# EAGLE design WeatherSharkCustom (EAGLE 8.3.2)
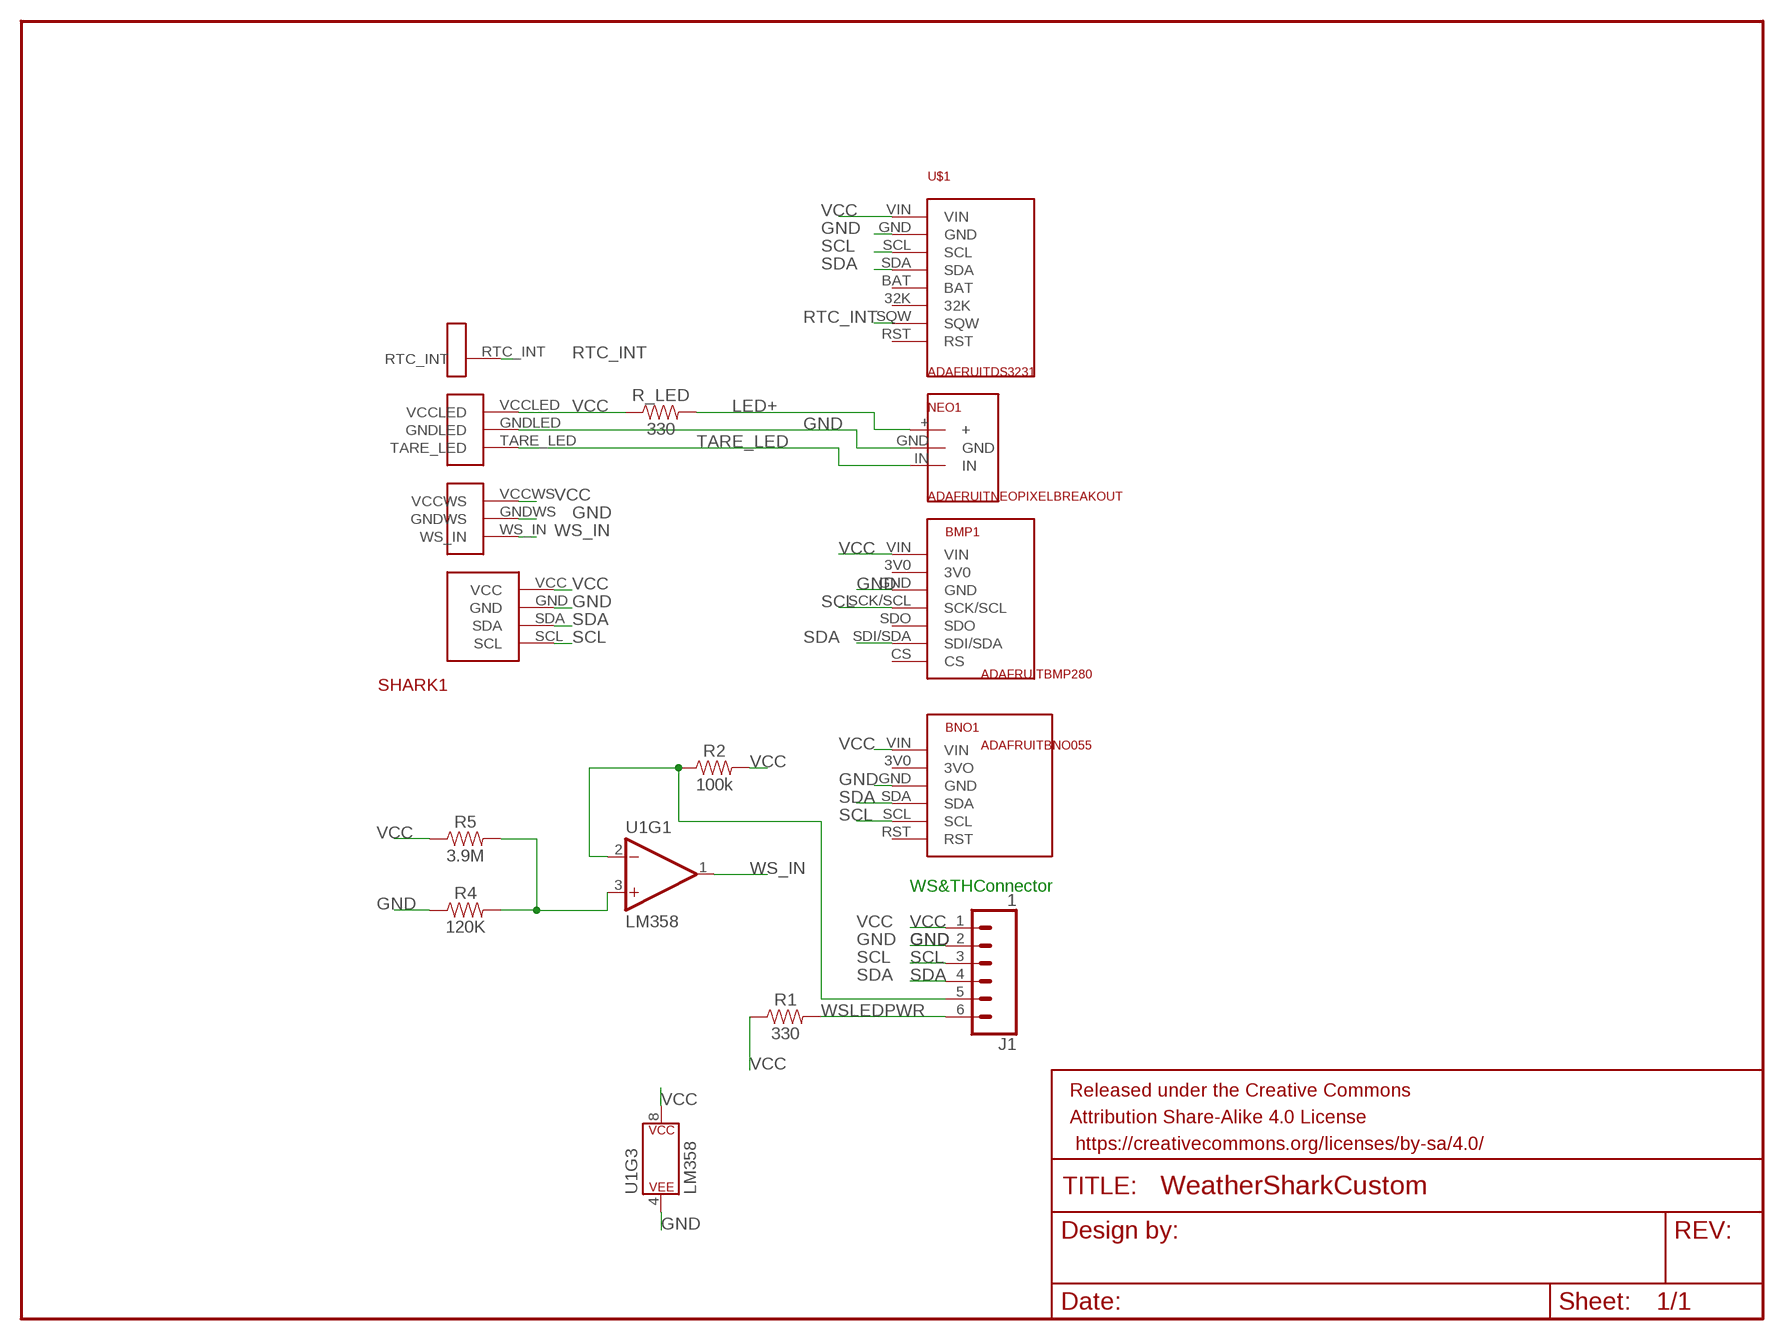
[diagram p0: schematic, sheet 1]

## Parts
BMP1  ADAFRUITBMP280  [ADAFRUITBMP280]
BNO1  ADAFRUITBNO055  [ADAFRUITBNO055]
FRAME1  FRAME-LETTER  [CREATIVE_COMMONS]
J1  1  CONN_06POLAR  [MOLEX-1X6]
NEO1  ADAFRUITNEOPIXELBREAKOUT  [ADAFRUITNEOPIXELBREAKOUT]
R1  330  330OHM-HORIZ-1/10W-5%  [AXIAL-0.3]
R2  100k  100KOHM-HORIZ-1/4W-1%  [AXIAL-0.3]
R4  120K  330OHM-HORIZ-1/10W-5%  [AXIAL-0.3]
R5  3.9M  330OHM-HORIZ-1/10W-5%  [AXIAL-0.3]
R_LED  330  330OHM-HORIZ-1/10W-5%  [AXIAL-0.3]
SHARK1  EVAPSHARK  [EVAPSHARK]
U1  LM358  LM358KIT  [DIP08-KIT]
U$1  ADAFRUITDS3231  [ADAFRUITDS3231]

## Nets
COMP: R4.P$2 R5.P$2 U1.3(+IN)
GND: BMP1.GND BNO1.GND J1.2 NEO1.GND R4.P$1 SHARK1.GND SHARK1.GNDLED SHARK1.GNDWS U1.4(P$V-) U$1.GND
LED+: NEO1.+ R_LED.P$2
RTC_INT: SHARK1.RTC_INT U$1.SQW
SCL: BMP1.SCK/SCL BNO1.SCL J1.3 SHARK1.SCL U$1.SCL
SDA: BMP1.SDI/SDA BNO1.SDA J1.4 SHARK1.SDA U$1.SDA
TARE_LED: NEO1.IN SHARK1.TARE_LED
VCC: BMP1.VIN BNO1.VIN J1.1 R1.P$1 R2.P$2 R5.P$1 R_LED.P$1 SHARK1.VCC SHARK1.VCCLED SHARK1.VCCWS U1.8(P$V+) U$1.VIN
WS_IN: SHARK1.WS_IN U1.1(OUT)
WSLEDPWR: J1.6 R1.P$2
WSSIGNAL: J1.5 R2.P$1 U1.2(-IN)
Unconnected: BMP1.3V0 BMP1.CS BMP1.SDO BNO1.3V0(3VO) BNO1.RST U1.5(+IN) U1.6(-IN) U1.7(OUT) U$1.32K U$1.BAT U$1.RST

## Notes on the sheet
- WS&THConnector

## Library data of the parts
BMP1 = WeatherShark:ADAFRUITBMP280
BNO1 = WeatherShark:ADAFRUITBNO055: BNO055 Footprint for use with weatheshark, etc
FRAME1 = SparkFun-Aesthetics:FRAME-LETTER: Schematic Frame Standard 8.5x11 US Letter frame
J1 = SparkFun-Connectors:CONN_06: Multi connection point. Often used as Generic Header-pin footprint for 0.1 inch spaced/style header connections On any of the 0.1 inch spaced packages, you can populate with these: Break Away Headers - Straight <https://www.sparkfun.com/products/116> (PRT-00116) Break Away Male Headers - Right Angle <https://www.sparkfun.com/products/553> (PRT-00553) Female Headers <https://www.sparkfun.com/products/115> (PRT-00115) Break Away Headers - Machine Pin <https://www.sparkfun.com/products/117> (PRT-00117) Break Away Female Headers - Swiss Machine Pin <https://www.sparkfun.com/products/743> (PRT-00743) Arduino Stackable Header - 6 Pin <https://www.sparkfun.com/products/9280> (PRT-09280) For SCREWTERMINALS and SPRING TERMINALS visit here: Screw Terimnals on SparkFun.com <https://www.sparkfun.com/search/results?term=Screw+Terminals> (5mm/3.5mm/2.54mm spacing) This device is also useful as a general connection point to wire up your design to another part of your project. Our various solder wires solder well into these plated through hole pads. Hook-Up Wire - Assortment (Stranded, 22 AWG) <https://www.sparkfun.com/products/11375> (PRT-11375) Hook-Up Wire - Assortment (Solid Core, 22 AWG) <https://www.sparkfun.com/products/11367> (PRT-11367) View the entire wire category on our website here <https://www.sparkfun.com/categories/141>
NEO1 = WeatherShark:ADAFRUITNEOPIXELBREAKOUT: Neopixel Footprint for weather shark
R1 R_LED = SparkFun-Resistors:330OHM: 330Ω resistor A resistor is a passive two-terminal electrical component that implements electrical resistance as a circuit element. Resistors act to reduce current flow, and, at the same time, act to lower voltage levels within circuits. - Wikipedia; PROD_ID: RES-8371
R2 = SparkFun-Resistors:100KOHM: 100kΩ resistor A resistor is a passive two-terminal electrical component that implements electrical resistance as a circuit element. Resistors act to reduce current flow, and, at the same time, act to lower voltage levels within circuits. - Wikipedia; PROD_ID: RES-12184
R4 R5 = SparkFun-Resistors:330OHM: 330Ω resistor A resistor is a passive two-terminal electrical component that implements electrical resistance as a circuit element. Resistors act to reduce current flow, and, at the same time, act to lower voltage levels within circuits. - Wikipedia; PROD_ID: RES-8371; VALUE: 330
SHARK1 = WeatherShark:EVAPSHARK: EvapShark foot print for the weathershark
U1 = SparkFun-IC-Amplifiers:LM358: LM358 Jellybean op-amp Datasheet <http://www.sparkfun.com/datasheets/Components/General/LM358.pdf> SparkFun Products Op-Amp (Thru-Hole) - LM358 <https://www.sparkfun.com/products/9456> (COM-09456); PROD_ID: IC-09172
U$1 = WeatherShark:ADAFRUITDS3231: ADAFruit DS3231 foot print for Weather Shark

## Board
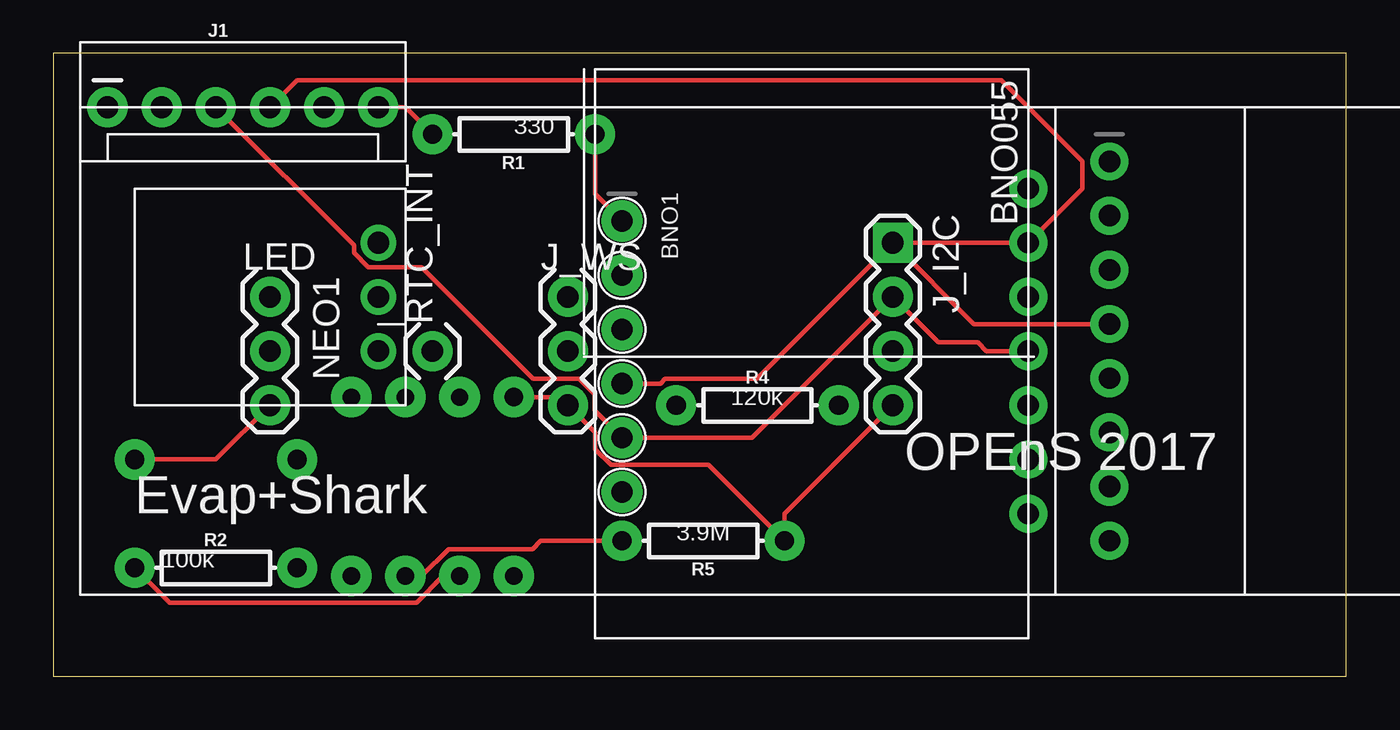
[diagram p1: board, top side]
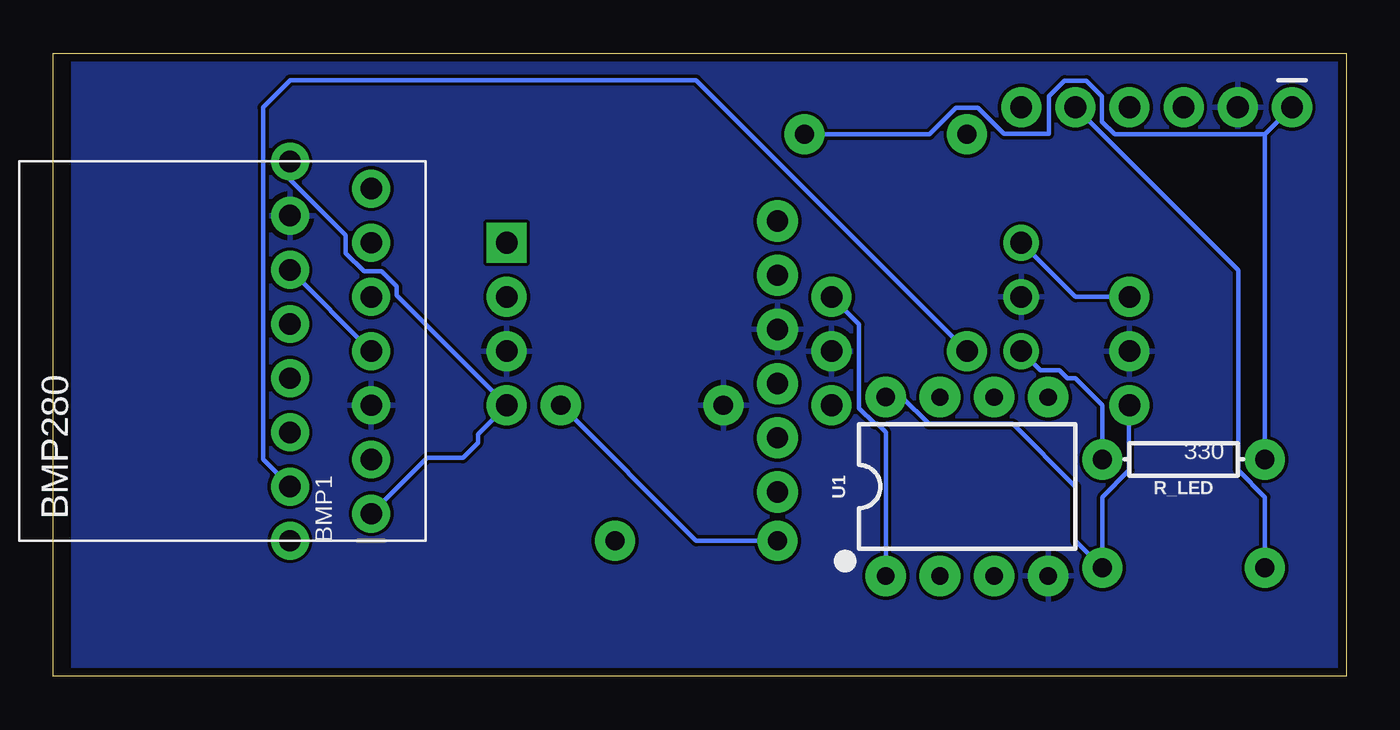
[diagram p2: board, bottom side, seen from below]

Size 60.63 x 29.2 mm. Coordinates in mm from the lower left corner, seen from the top.
Outline: 0,0 60.63,0 60.63,29.2 0,29.2 0,0
Copper layers (1*16): Top 0.0356mm / dielectric 1.5011mm / Bottom 0.0356mm
Design rules "oshpark-2layer": minimum track width 6mil, minimum drill 13mil, track to track 6mil, track to pad 6mil, pad to pad 6mil, via to via 6mil, smd to smd 6mil, copper to edge 15mil, drill to drill 6mil, minimum pad ring 7mil, minimum via ring 7mil, stop-mask expansion 2.5mil, vias tented up to drill 0mil, thermal gap 10mil

### Footprints (pad centres in the part's own frame; a part is rotated, then mirrored left to right if it is on the bottom)
ADAFRUITBMP280 = drill 1 pad 1.778: 3V0 3.81,2.54; CS 16.51,2.54; GND 6.35,2.54; SCK/SCL 8.89,2.54; SDI/SDA 13.97,2.54; SDO 11.43,2.54; VIN 1.27,2.54
ADAFRUITBNO055 = drill 1 pad 1.93: 3V0 -3.556,0; GND -1.016,0; RST 6.604,0; SCL 4.064,0; SDA 1.524,0; VIN -6.096,0
MOLEX-1X6 = drill 1.016 pad 1.88: 1 0,0; 2 2.54,0; 3 5.08,0; 4 7.62,0; 5 10.16,0; 6 12.7,0
ADAFRUITNEOPIXELBREAKOUT = drill 1.016 pad 1.676: + 11.43,2.54; GND 11.43,5.08; IN 11.43,7.62
AXIAL-0.3 = drill 0.9 pad 1.88: P$1 -3.81,0; P$2 3.81,0
EVAPSHARK = drill 1.016 pad 1.88: GND 0,2.54; GNDLED -29.21,2.54; GNDWS -15.24,2.54; RTC_INT -21.59,2.54; SCL 0,5.08; TARE_LED -29.21,5.08; VCC 0,0; VCCLED -29.21,0; VCCWS -15.24,0; WS_IN -15.24,5.08 | drill 1.016 pad 1.88 square: SDA 0,7.62
DIP08-KIT = drill 0.813 pad 1.905: 1 -3.81,-4.191; 2 -1.27,-4.191; 3 1.27,-4.191; 4 3.81,-4.191; 5 3.81,4.191; 6 1.27,4.191; 7 -1.27,4.191 | drill 0.864 pad 1.905: 8 -3.81,4.191
ADAFRUITDS3231 = drill 1 pad 1.778: 32K 15.24,2.54; BAT 12.7,2.54; GND 5.08,2.54; RST 20.32,2.54; SCL 7.62,2.54; SDA 10.16,2.54; SQW 17.78,2.54; VIN 2.54,2.54

### Placement (x,y rotation side)
BMP1  43.18,6.35 90 bottom
BNO1  26.67,15.24 270 top
FRAME1  -105.41,30.48 0 top  (outside the outline)
J1  2.54,26.67 0 top
NEO1  3.81,12.7 0 top
R1  21.59,25.4 180 top
R2  7.62,5.08 0 top
R4  33.02,12.7 0 top
R5  30.48,6.35 180 top
R_LED  7.62,10.16 180 bottom
SHARK1  39.37,12.7 0 top
U1  17.78,8.89 0 bottom
U$1  46.99,26.67 270 top

### Tracks (layer width: path | path; a pad name or v marks a point on that pad's centre or on a via)
COMP
  Top 0.203: U1.3 17.27,4.7 18.53,5.96 22.47,5.96 22.86,6.35 R5.P$2
  Bottom 0.203: R5.P$2 30.48,6.35 R4.P$2
GND
  pour Bottom: 0,29.21 59.69,29.21 59.69,0 0,0
LED+
  Bottom 0.203: R_LED.P$2 11.43,12.7 12.7,13.97 13.08,13.97 13.45,14.34 14.34,14.34 NEO1.+
RTC_INT
  Bottom 0.203: SHARK1.RTC_INT 30.48,27.94 49.53,27.94 50.8,26.67 50.8,10.16 U$1.SQW
SCL
  Top 0.203: J1.3 14.1,20.19 14.1,19.85 14.77,19.18 17.27,19.18 22.5,13.95 24.65,13.95 25.38,13.22 25.38,12.47 BNO1.SCL 32.77,11.18 SHARK1.SCL 41.5,15.65 43.35,15.65 43.76,15.24 BMP1.SCK/SCL
  Bottom 0.203: BMP1.SCK/SCL U$1.SCL
SDA
  Top 0.203: BNO1.SDA 28.47,13.72 28.69,13.95 33,13.95 SHARK1.SDA | SHARK1.SDA BMP1.SDI/SDA 48.26,22.86 48.26,24.13 44.45,27.94 11.43,27.94 J1.4 | U$1.SDA 43.18,16.51 SHARK1.SDA
TARE_LED
  Bottom 0.203: SHARK1.TARE_LED 12.7,17.78 NEO1.IN
VCC
  Top 0.203: U1.8 23.75,13.08 SHARK1.VCCWS 25.4,11.43 25.4,10.65 26.14,9.91 30.73,9.91 R5.P$1 34.29,7.62 SHARK1.VCC | R_LED.P$1 7.62,10.16 SHARK1.VCCLED | R1.P$1 25.4,22.61 BNO1.VIN
  Bottom 0.203: BMP1.VIN 43.1,10.24 41.42,10.24 40.72,10.94 40.72,11.35 SHARK1.VCC 44.53,17.86 44.53,18.27 45.23,18.97 46.06,18.97 46.91,19.83 46.91,20.66 49.53,23.28 U$1.VIN | U1.8 20.83,13.08 19.57,11.82 15.63,11.82 12.7,8.89 12.7,6.35 R2.P$2 11.43,8.4 10.19,9.64 10.19,12.68 SHARK1.VCCLED | 3.81,25.4 R_LED.P$1 | 3.81,25.4 J1.1 | 3.81,25.4 10.86,25.4 11.45,26 11.45,27.19 12.18,27.91 13.22,27.91 13.95,27.19 13.95,25.43 16.05,25.43 17.26,26.65 18.3,26.65 19.54,25.4 R1.P$1
WS_IN
  Bottom 0.203: U1.1 21.59,11.43 21.98,11.82 22.11,11.82 22.85,12.56 22.85,16.5 SHARK1.WS_IN
WSLEDPWR
  Top 0.203: J1.6 16.51,26.67 R1.P$2
WSSIGNAL
  Top 0.203: U1.2 18.29,4.7 17.03,3.44 5.45,3.44 R2.P$1
  Bottom 0.203: R2.P$1 3.81,8.4 5.05,9.64 5.05,19.03 J1.5

### Text on the board
tPlace: 330 | 120k | 3.9M | 100k
bPlace: 330